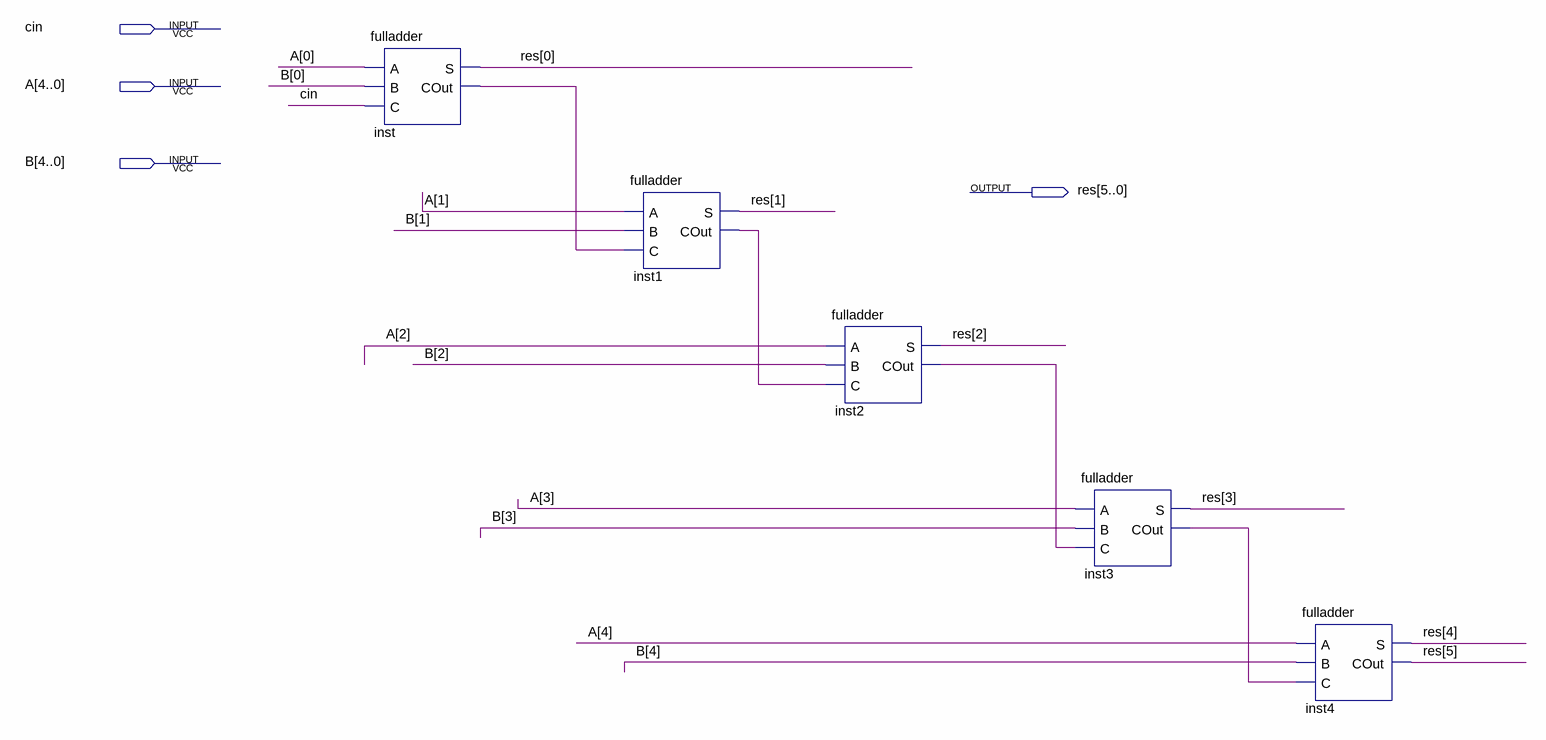
[diagram p0: schematic sheet]
// Quartus schematic 5bitFA.bdf as structural Verilog: 5 symbols, 4 pins
module \5bitFA  (
  input  cin,
  input  [4:0] A,
  input  [4:0] B,
  output [5:0] res
);

  wire inst1_cout, inst2_cout, inst3_cout, inst_cout;

  fulladder inst (.A(A[0]), .B(B[0]), .C(cin), .S(res[0]), .COut(inst_cout));
  fulladder inst1 (.A(A[1]), .B(B[1]), .C(inst_cout), .S(res[1]), .COut(inst1_cout));
  fulladder inst2 (.A(A[2]), .B(B[2]), .C(inst1_cout), .S(res[2]), .COut(inst2_cout));
  fulladder inst3 (.A(A[3]), .B(B[3]), .C(inst2_cout), .S(res[3]), .COut(inst3_cout));
  fulladder inst4 (.A(A[4]), .B(B[4]), .C(inst3_cout), .S(res[4]), .COut(res[5]));
endmodule
